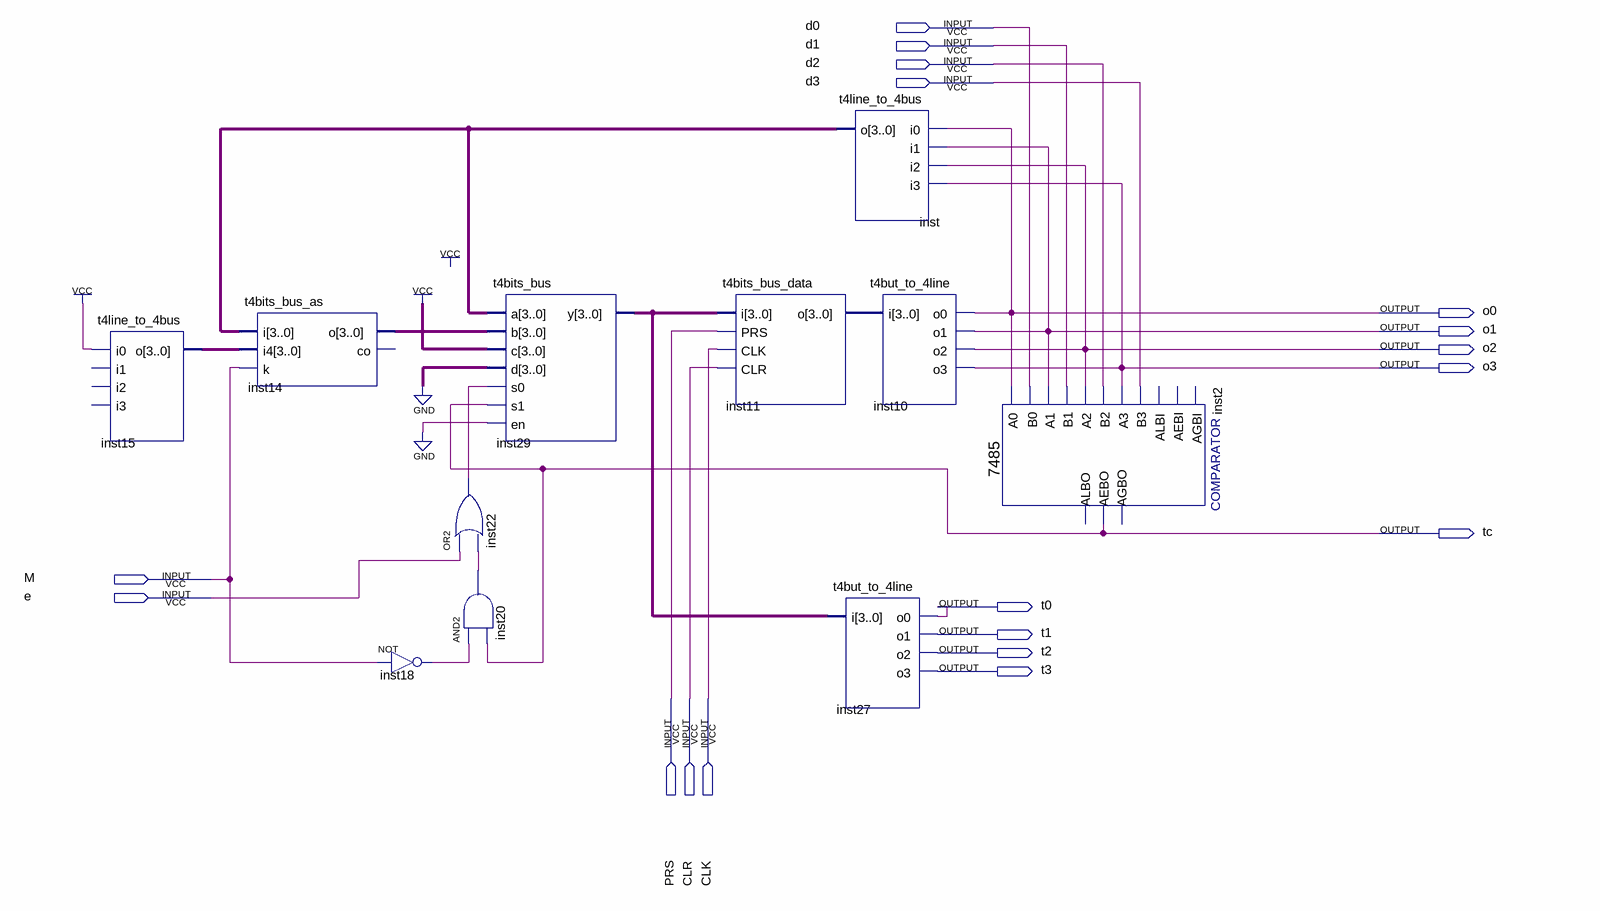
[diagram p0: schematic sheet]
// Quartus schematic t4bits_as_main.bdf as structural Verilog: 11 symbols, 18 pins
module t4bits_as_main (
  input  d0,
  input  d1,
  input  d2,
  input  d3,
  input  M,
  input  e,
  input  PRS,
  input  CLR,
  input  CLK,
  output o0,
  output o1,
  output o2,
  output o3,
  output tc,
  output t0,
  output t1,
  output t2,
  output t3
);

  wire inst18_out, inst20_out, inst22_out;
  wire [3:0] inst11_o, inst14_o, inst15_o, inst29_y, inst_o;

  t4line_to_4bus inst15 (.i0(1'b1), .o(inst15_o));  // open: i1, i2, i3
  t4bits_bus_as inst14 (.i(inst_o), .i4(inst15_o), .k(M), .o(inst14_o));  // open: co
  not inst18 (inst18_out, M);
  or inst22 (inst22_out, e, inst20_out);
  and inst20 (inst20_out, inst18_out, tc);
  t4bits_bus inst29 (
    .a(inst_o), .b(inst14_o), .c(4'b1111), .d(4'b0000), .s0(inst22_out), .s1(tc), .en(1'b0), .y(inst29_y));
  t4bits_bus_data inst11 (.i(inst29_y), .PRS(PRS), .CLK(CLK), .CLR(CLR), .o(inst11_o));
  t4but_to_4line inst27 (.i(inst29_y), .o0(t0), .o1(t1), .o2(t2), .o3(t3));
  t4line_to_4bus inst (.i0(o0), .i1(o1), .i2(o2), .i3(o3), .o(inst_o));
  t4but_to_4line inst10 (.i(inst11_o), .o0(o0), .o1(o1), .o2(o2), .o3(o3));
  \7485  inst2 (
    .A3(o3), .B2(d2), .A2(o2), .A0(o0), .B0(d0), .B3(d3), .A1(o1), .B1(d1), .AEBO(tc));  // open: AEBI, AGBI, ALBI, ALBO, AGBO
endmodule
